# EAGLE schematic POV (EAGLE 6.5.0)
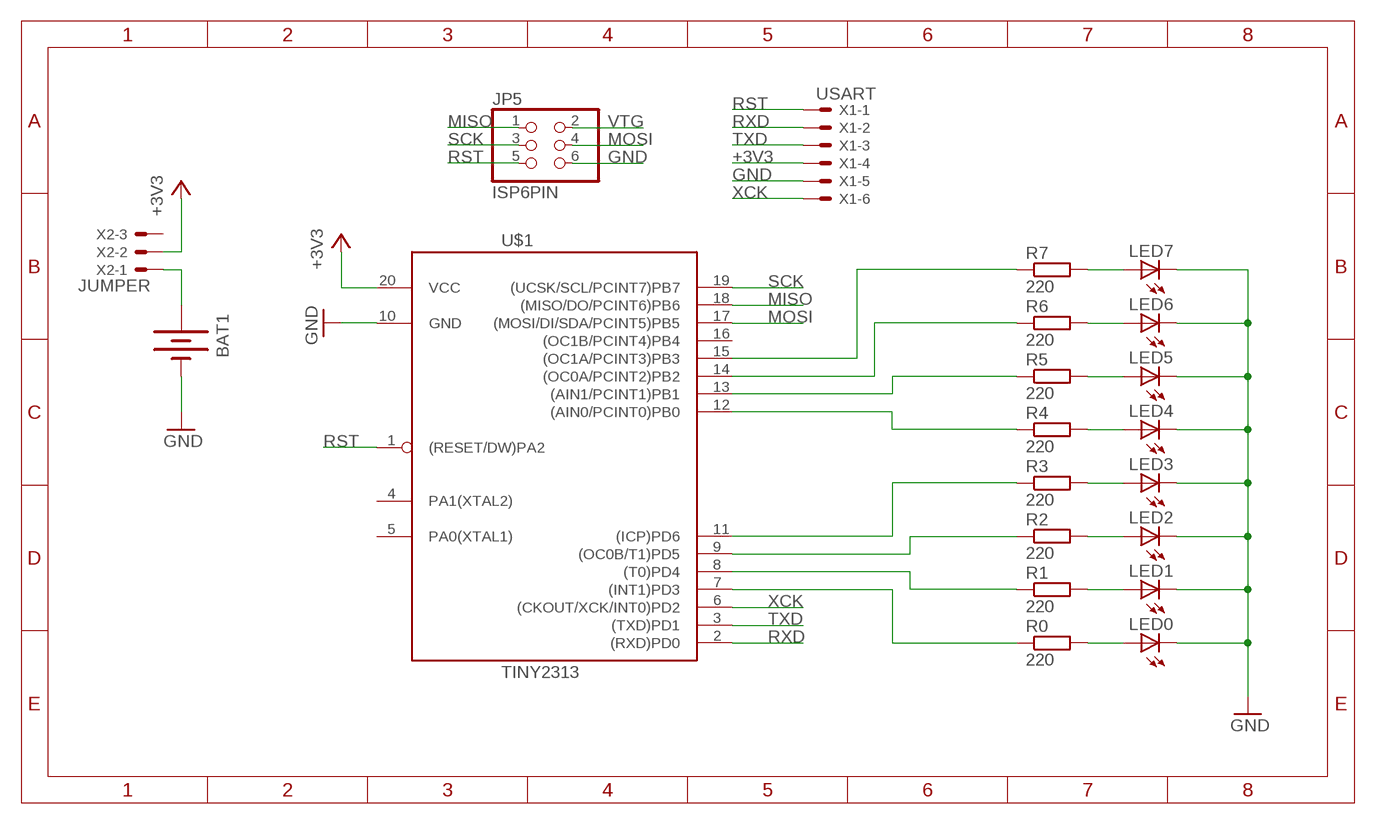
[diagram p0: schematic, sheet 1]

## Parts
BAT1  BATTERY20PTH  [BATTCOM_20MM_PTH]
JP5  ISP6PIN  PINHD-2X3  [2X03]
LED0  LED3MM  [LED3MM]
LED1  LED3MM  [LED3MM]
LED2  LED3MM  [LED3MM]
LED3  LED3MM  [LED3MM]
LED4  LED3MM  [LED3MM]
LED5  LED3MM  [LED3MM]
LED6  LED3MM  [LED3MM]
LED7  LED3MM  [LED3MM]
R0  220  R-EU_0207/10  [0207/10]
R1  220  R-EU_0207/10  [0207/10]
R2  220  R-EU_0207/10  [0207/10]
R3  220  R-EU_0207/10  [0207/10]
R4  220  R-EU_0207/10  [0207/10]
R5  220  R-EU_0207/10  [0207/10]
R6  220  R-EU_0207/10  [0207/10]
R7  220  R-EU_0207/10  [0207/10]
U$1  TINY2313  [DIL20]
X1  USART  22-23-2061  [22-23-2061]
X2  JUMPER  22-23-2031  [22-23-2031]

## Nets
+3V3: U$1.20(VCC) X1.4 X2.2
GND: BAT1.2(-) JP5.6 LED0.K(C) LED1.K(C) LED2.K(C) LED3.K(C) LED4.K(C) LED5.K(C) LED6.K(C) LED7.K(C) U$1.10(GND) X1.5
MISO: JP5.1 U$1.18((MISO/DO/PCINT6)PB6)
MOSI: JP5.4 U$1.17((MOSI/DI/SDA/PCINT5)PB5)
N$1: R0.1 U$1.7((INT1)PD3)
N$2: R1.1 U$1.8((T0)PD4)
N$3: R2.1 U$1.9((OC0B/T1)PD5)
N$4: R3.1 U$1.11((ICP)PD6)
N$5: R4.1 U$1.12((AIN0/PCINT0)PB0)
N$6: R5.1 U$1.13((AIN1/PCINT1)PB1)
N$7: R6.1 U$1.14((OC0A/PCINT2)PB2)
N$8: R7.1 U$1.15((OC1A/PCINT3)PB3)
N$9: LED7.A R7.2
N$10: LED6.A R6.2
N$11: LED5.A R5.2
N$12: LED4.A R4.2
N$13: LED3.A R3.2
N$14: LED2.A R2.2
N$15: LED1.A R1.2
N$16: LED0.A R0.2
N$17: BAT1.1(+) X2.1
RST: JP5.5 U$1.1((RESET/DW)PA2) X1.1
RXD: U$1.2((RXD)PD0) X1.2
SCK: JP5.3 U$1.19((UCSK/SCL/PCINT7)PB7)
TXD: U$1.3((TXD)PD1) X1.3
VTG: JP5.2
XCK: U$1.6((CKOUT/XCK/INT0)PD2) X1.6
Unconnected: U$1.4(PA1(XTAL2)) U$1.5(PA0(XTAL1)) U$1.16((OC1B/PCINT4)PB4) X2.3

## Library data of the parts
BAT1 = SparkFun-Electromechanical:BATTERY: Battery Holders Various common sizes : AA, AAA, 20mm coin cell and 12mm coin cell. 20MM_4LEGS, BATT-10373
JP5 = pinhead:PINHD-2X3: PIN HEADER
LED0 LED1-LED7 = led:LED: LED OSRAM: - CHIPLED LG R971, LG N971, LY N971, LG Q971, LY Q971, LO R971, LY R971 LH N974, LH R974 LS Q976, LO Q976, LY Q976 LO Q996 - Hyper CHIPLED LW Q18S LB Q993, LB Q99A, LB R99A - SideLED LS A670, LO A670, LY A670, LG A670, LP A670 LB A673, LV A673, LT A673, LW A673 LH A674 LY A675 LS A676, LA A676, LO A676, LY A676, LW A676 LS A679, LY A679, LG A679 - Hyper Micro SIDELED® LS Y876, LA Y876, LO Y876, LY Y876 LT Y87S - SmartLED LW L88C, LW L88S LB L89C, LB L89S, LG L890 LS L89K, LO L89K, LY L89K LS L896, LA L896, LO L896, LY L896 - TOPLED LS T670, LO T670, LY T670, LG T670, LP T670 LSG T670, LSP T670, LSY T670, LOP T670, LYG T670 LG T671, LOG T671, LSG T671 LB T673, LV T673, LT T673, LW T673 LH T674 LS T676, LA T676, LO T676, LY T676, LB T676, LH T676, LSB T676, LW T676 LB T67C, LV T67C, LT T67C, LS T67K, LO T67K, LY T67K, LW E67C LS E67B, LA E67B, LO E67B, LY E67B, LB E67C, LV E67C, LT E67C LW T67C LS T679, LY T679, LG T679 LS T770, LO T770, LY T770, LG T770, LP T770 LB T773, LV T773, LT T773, LW T773 LH T774 LS E675, LA E675, LY E675, LS T675 LS T776, LA T776, LO T776, LY T776, LB T776 LHGB T686 LT T68C, LB T68C - Hyper Mini TOPLED® LB M676 - Mini TOPLED Santana® LG M470 LS M47K, LO M47K, LY M47K Source: http://www.osram.convergy.de LUXEON: - LUMILED® LXK2-PW12-R00, LXK2-PW12-S00, LXK2-PW14-U00, LXK2-PW14-V00 LXK2-PM12-R00, LXK2-PM12-S00, LXK2-PM14-U00 LXK2-PE12-Q00, LXK2-PE12-R00, LXK2-PE12-S00, LXK2-PE14-T00, LXK2-PE14-U00 LXK2-PB12-K00, LXK2-PB12-L00, LXK2-PB12-M00, LXK2-PB14-N00, LXK2-PB14-P00, LXK2-PB14-Q00 LXK2-PR12-L00, LXK2-PR12-M00, LXK2-PR14-Q00, LXK2-PR14-R00 LXK2-PD12-Q00, LXK2-PD12-R00, LXK2-PD12-S00 LXK2-PH12-R00, LXK2-PH12-S00 LXK2-PL12-P00, LXK2-PL12-Q00, LXK2-PL12-R00 Source: www.luxeon.com KINGBRIGHT: KA-3528ASYC Source: www.kingbright.com
R0 R1-R7 = resistor:R-EU_: RESISTOR, European symbol
U$1 = avr-5:TINY2313
X1 = con-molex:22-23-2061: .100" (2.54mm) Center Header - 6 Pin; MF: MOLEX; MPN: 22-23-2061; OC_FARNELL: 1462922; OC_NEWARK: 27C1933
X2 = con-molex:22-23-2031: .100" (2.54mm) Center Header - 3 Pin; MF: MOLEX; MPN: 22-23-2031; OC_FARNELL: 1462950; OC_NEWARK: 30C0862